# Altium schematic sheet Sheet4.SchDoc
size B; SheetNumber: 2; SheetTotal: 2
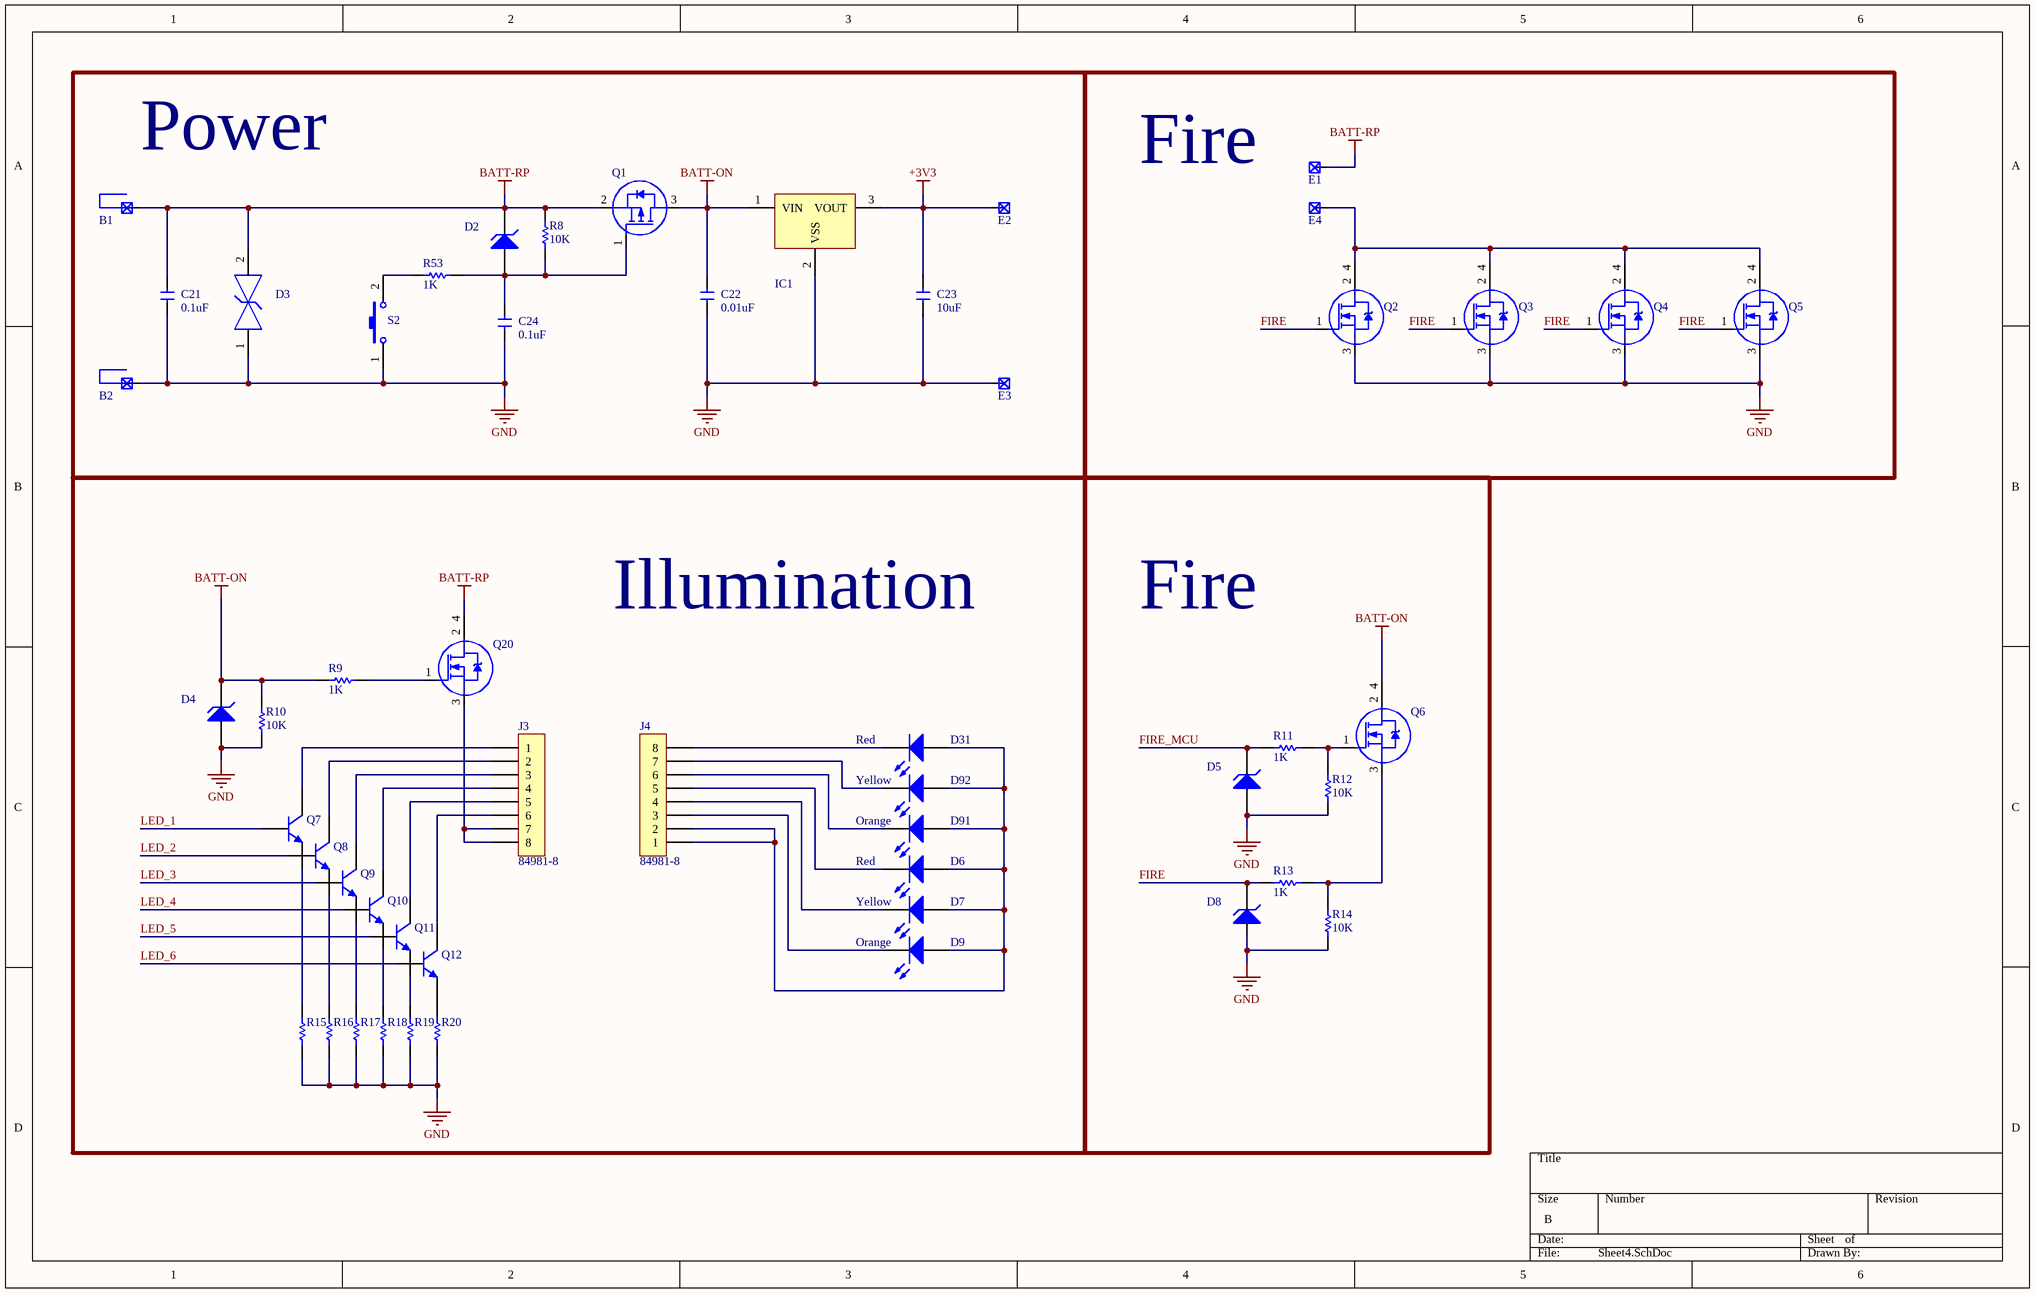
[diagram p0: Sheet4.SchDoc]

## Parts
B1  BATT CONTACT  [BATTERY CONTACT KEYSTONE 209]  (value not drawn)  (no BOM)
B2  BATT CONTACT  [BATTERY CONTACT KEYSTONE 209]  (value not drawn)  (no BOM)
C21  0.1uF  [CAPC2012N]
C22  0.01uF  [CAPC2012N]
C23  10uF  [CAPC2012N]
C24  0.1uF  [CAPC2012N]
D2  Diode, Zener, BZX84C18  [SOT23]  (value not drawn)
D3  SMAJ24CA  [FP-SMAJ-CA-MFG]  (value not drawn)
D4  Diode, Zener, BZX84C18  [SOT23]  (value not drawn)
D5  Diode, Zener, BZX84C18  [SOT23]  (value not drawn)
D6  LED_RED_0603  [LED_LTST-C190KRKT]  (value not drawn)
D7  LED_YELLOW_LTST-C194KSKT  [LED_LTST-C194KSKT]  (value not drawn)
D8  Diode, Zener, BZX84C18  [SOT23]  (value not drawn)
D9  LED_ORANGE_0603  [LED_LTST-C190KFKT]  (value not drawn)
D31  LED_RED_0603  [LED_LTST-C190KRKT]  (value not drawn)
D91  LED_ORANGE_0603  [LED_LTST-C190KFKT]  (value not drawn)
D92  LED_YELLOW_LTST-C194KSKT  [LED_LTST-C194KSKT]  (value not drawn)
E1  Testpoint  [Test_point]  (value not drawn)  (no BOM)
E2  Testpoint  [Test_point]  (value not drawn)  (no BOM)
E3  Testpoint  [Test_point]  (value not drawn)  (no BOM)
E4  Testpoint  [Test_point]  (value not drawn)  (no BOM)
IC1  LP2950  [DPAK-369C]  (value not drawn)
J3  84981-8  [84981-8]
J4  84981-8  [84981-8]
Q1  BSS84LT1G  [SOT23]  (value not drawn)
Q2  QD2PAK  [D2PAK]  (value not drawn)
Q3  QD2PAK  [D2PAK]  (value not drawn)
Q4  QD2PAK  [D2PAK]  (value not drawn)
Q5  QD2PAK  [D2PAK]  (value not drawn)
Q6  FQT7N10LTF  [SOT223-4N]  (value not drawn)
Q7  BC846B  [SOT23]  (value not drawn)
Q8  BC846B  [SOT23]  (value not drawn)
Q9  BC846B  [SOT23]  (value not drawn)
Q10  BC846B  [SOT23]  (value not drawn)
Q11  BC846B  [SOT23]  (value not drawn)
Q12  BC846B  [SOT23]  (value not drawn)
Q20  FQT7N10LTF  [SOT223-4N]  (value not drawn)
R8  10K  [RESC2012N]
R9  Resistance (Ohms): 1K  [RESC2012N]  (hidden comment: Res_1.0K_0805)
R10  10K  [RESC2012N]
R11  Resistance (Ohms): 1K  [RESC2012N]  (hidden comment: Res_1.0K_0805)
R12  10K  [RESC2012N]
R13  Resistance (Ohms): 1K  [RESC2012N]  (hidden comment: Res_1.0K_0805)
R14  10K  [RESC2012N]
R15  150  [RESC2012N]  (value not drawn)
R16  150  [RESC2012N]  (value not drawn)
R17  150  [RESC2012N]  (value not drawn)
R18  150  [RESC2012N]  (value not drawn)
R19  150  [RESC2012N]  (value not drawn)
R20  150  [RESC2012N]  (value not drawn)
R53  Resistance (Ohms): 1K  [RESC2012N]  (hidden comment: Res_1.0K_0805)
S2  SW_MX1A  [SW_CHERRY_MX1A-21NW]  (value not drawn)

## Blocks framed on the sheet
Power: B1 B2 C21-C24 D2 D3 E2 E3 IC1 Q1 R8 R53 S2
Fire: E1 E4 Q2-Q5
Illumination: D4 D6 D7 D9 D31 D91 D92 J3 J4 Q7-Q12 Q20 R9 R10 R15-R20
Fire: D5 D8 Q6 R11-R14

## Nets
+3V3: C23.2 E2.1(Test) IC1.3(VOUT)
BATT-ON: C22.2 D4.3(K) IC1.1(VIN) Q1.3 Q6.4(D) R9.2 R10.2
BATT-RP: B1.1(Test) C21.2 D2.3(K) D3.2 E1.1(Test) Q1.2 Q20.4(D) R8.2
GND: B2.1(Test) C21.1 C22.1 C23.1 C24.1 D3.1 D4.1(A) D5.1(A) D8.1(A) E3.1(Test) IC1.2(VSS) Q2.3(S) Q3.3(S) Q4.3(S) Q5.3(S) R10.1 R12.1 R14.1 R15.1 R16.1 R17.1 R18.1 R19.1 R20.1 S2.1
FIRE: D8.3(K) Q2.1(G) Q3.1(G) Q4.1(G) Q5.1(G) R13.2
FIRE_MCU: D5.3(K) R11.2
LED_1: Q7.1(B)
LED_2: Q8.1(B)
LED_3: Q9.1(B)
LED_4: Q10.1(B)
LED_5: Q11.1(B)
LED_6: Q12.1(B)
NetC24_2: C24.2 D2.1(A) Q1.1 R8.1 R53.1
NetD6_1: D6.1 J4.5
NetD6_2: D6.2 D7.2 D9.2 D31.2 D91.2 D92.2 J4.1 J4.2
NetD7_1: D7.1 J4.4
NetD9_1: D9.1 J4.3
NetD31_1: D31.1 J4.8
NetD91_1: D91.1 J4.6
NetD92_1: D92.1 J4.7
NetE4_1: E4.1(Test) Q2.4(D) Q3.4(D) Q4.4(D) Q5.4(D)
NetJ3_1: J3.1 Q7.3(C)
NetJ3_2: J3.2 Q8.3(C)
NetJ3_3: J3.3 Q9.3(C)
NetJ3_4: J3.4 Q10.3(C)
NetJ3_5: J3.5 Q11.3(C)
NetJ3_6: J3.6 Q12.3(C)
NetJ3_7: J3.7 J3.8 Q20.3(S)
NetQ6_1: Q6.1(G) R11.1 R12.2
NetQ6_3: Q6.3(S) R13.1 R14.2
NetQ7_2: Q7.2(E) R15.2
NetQ8_2: Q8.2(E) R16.2
NetQ9_2: Q9.2(E) R17.2
NetQ10_2: Q10.2(E) R18.2
NetQ11_2: Q11.2(E) R19.2
NetQ12_2: Q12.2(E) R20.2
NetQ20_1: Q20.1(G) R9.1
NetR53_2: R53.2 S2.2

Not connected (* = marked no-connect by the designer): Q2 2(D); Q3 2(D); Q4 2(D); Q5 2(D); Q6 2(D); Q20 2(D)

## Notes on the sheet
- Red
- (near D92) Yellow
- (near D91) Orange
- (near D7) Yellow
- (near D9) Orange

## Library data of the parts
B1 B2 = BATT_Contact_Keystone_209: Manufacturer: Keystone Electronics; Manufacturer P/N: 209; Body Plating: Nickel; Body Material: Steel; Voltage Rating: 0uV; Number of Batteries: 1; Insulation: Non-Insulated; Material Thickness: 0.012inch; Supplier 1: Digi-Key; Supplier Part Number 1: 36-209-ND; Mount: Snap in; Case/Package: Molded; Contact Plating: Nickel,Tin; Contact Material: Steel; Material: Brass,Steel; Package Quantity: 100; Termination: Solder; Voltage Rating (DC): 0uV; Length: 7.9mm; Height: 0.449inch; Depth: 11.4mm; Thickness: 0.012inch; REACH SVHC: No SVHC; Lead Free: Lead Free; ComponentLink2URL: http://www.keyelco.com/userAssets/file/M60-2p12.pdf; ComponentLink2Description: http://www.keyelco.com/userAssets/file/M60-2p12.pdf
C21 C24 = Cap_0.1uF_50V_0805: CAP CER 0.1UF 50V; Manufacturer: KEMET; Manufacturer P/N: C0805C104M5RACAUTO; Dielectric Material: Ceramic; Tolerance: 20%; Dielectric: X7R; Capacitance: 100nF; Supplier 1: Digi-Key; Supplier Part Number 1: 399-12977-1-ND; Mount: Surface Mount; Case/Package: 0805; Case Code (Metric): 2012; Case Code (Imperial): 0805; Contact Plating: Matte,Tin; Min Operating Temperature: -55°C; Max Operating Temperature: 125°C; Voltage Rating: 50V; Voltage Rating (DC): 50V; Termination: Wraparound; Length: 2mm; Width: 0.049inch; Thickness: 0.035inch; Depth: 1.25mm; Ratings: AEC-Q200; REACH SVHC: No SVHC
C22 = Cap_0.01uF_50V_0805: CAP CER 0.01UF 50V; Manufacturer: KEMET; Manufacturer P/N: C0805C103K5RAC-TU; Dielectric Material: Ceramic; Capacitance: 10nF; Tolerance: 10%; Dielectric: X7R; Supplier 1: Digi-Key; Supplier Part Number 1: 399-1158-6-ND; Mount: PCB,Surface Mount; Case/Package: 0805; Number of Pins: 2; Case Code (Metric): 2012; Case Code (Imperial): 0805; Min Operating Temperature: -55°C; Max Operating Temperature: 125°C; Voltage Rating (DC): 50V; Voltage Rating: 50V; Package Quantity: 1; Termination: SMD/SMT; Voltage: 50V; Length: 2mm; Height: 0.78mm; Width: 0.049inch; Lead Pitch: 0.75mm; Depth: 1.25mm; Thickness: 0.035inch; Radiation Hardening: No; REACH SVHC: No SVHC; ComponentLink1URL: http://www.kemet.com/kemet/web/homepage/kechome.nsf/vapubfiles/KEM_C1002_X7R_SMD.pdf/$file/KEM_C1002_X7R_SMD.pdf; ComponentLink1Description: http://www.kemet.com/kemet/web/homepage/kechome.nsf/vapubfiles/KEM_C1002_X7R_SMD.pdf/$file/KEM_C1002_X7R_SMD.pdf
C23 = Cap_10uF_10V_0805: CAP CER 10uF 10V 0805; Manufacturer: TDK; Manufacturer P/N: C2012X7R1A106K125AC; Dielectric Material: Ceramic; Tolerance: 10%; Dielectric: X7R; Supplier 1: Digi-Key; Supplier Part Number 1: 445-6857-1-ND; Mount: Surface Mount; Case/Package: 0805; Number of Pins: 2; Weight: 0.000194oz; Case Code (Metric): 2012; Case Code (Imperial): 0805; Contact Plating: Matte,Tin; Min Operating Temperature: -55°C; Max Operating Temperature: 125°C; Capacitance: 10uF; Voltage Rating: 10V; Package Quantity: 1; Voltage Rating (DC): 10V; Termination: SMD/SMT; Composition: Ceramic; Voltage: 10V; Length: 2mm; Height: 1.25mm; Width: 0.049inch; Thickness: 0.057inch; Depth: 1.25mm; Radiation Hardening: No; REACH SVHC: No SVHC; Lead Free: Lead Free; ComponentLink3URL: http://product.tdk.com/capacitor/mlcc/en/documents/mlcc_commercial_general_en.pdf; ComponentLink3Description: http://product.tdk.com/capacitor/mlcc/en/documents/mlcc_commercial_general_en.pdf
D2 D4 D5 D8 = Diode_BZX84C18: DIODE ZENER 18V 300mW SOT23; Manufacturer: Diodes; Manufacturer P/N: BZX84C18-7-F; Max Power Dissipation: 350mW; Max Reverse Leakage Current: 100nA; Tolerance: 6%; Zener Current: 5mA; Output Current: 18mA; Supplier 1: Digi-Key; Supplier Part Number 1: BZX84C18-FDICT-ND; Case/Package: SOT-23; Number of Pins: 3; Min Operating Temperature: -65°C; Max Operating Temperature: 150°C; Zener Voltage: 18V; Voltage Tolerance: 6%; Working Voltage: 18V; Peak Reverse Current: 100nA; Test Current: 5mA; Power Rating: 350mW; Voltage Rating (DC): 18V; Lead Free: Lead Free; ComponentLink1Description: https://www.diodes.com/assets/Datasheets/ds18001.pdf
D3 = CMP-2000-07087-2: TVS DIODE 24V 38.9V DO214AC; Manufacturer: Littelfuse; Peak Pulse Power: 400W; Direction: Bidirectional; Breakdown Voltage: 26.7V; Max Junction Temp: +150°C; Number Of Channels: 1; Description: 38.9V Clamp 10.3A Ipp Tvs Diode Surface Mount DO-214AC (SMA); Peak Pulse Current: 10.3A; Digikey Description: TVS DIODE 24V 38.9V DO214AC; Temperature Range Low: -65°C; Temperature: -65°C to +150°C; Manufacturer Part Number: SMAJ24CA; Octopart: https://octopart.com/smaj24ca-littelfuse-350011; Height: 2.29mm; Clamping Voltage: 38.9V; Device Class L1: Circuit Protection; Automotive: No; Device Class L2: TVS Diodes; Package: SMAJ-CA; ComponentLink2URL: https://www.littelfuse.com/~/media/electronics/datasheets/tvs_diodes/littelfuse_tvs_diode_smaj_datasheet.pdf.pdf; RoHS: TRUE; Temperature Range High: +150°C; Category: Diode; Lead Free: Yes; Reverse Standoff Voltage: 24V; Device Class L3: unset; ComponentLink2Description: Datasheet; Mouser Description: In a Pack of 25, Littelfuse SMAJ24CA, Bi-Directional TVS Diode, 400W, 2-Pin DO-214AC
D6 D31 = LED_RED_LTST-C190: LED RED 0603 SMD; Manufacturer: Vishay Lite-On; Manufacturer P/N: LTST-C190KRKT; Lens Color: Clear,Colorless; Luminous Intensity: 54mcd; Forward Current: 30mA; Viewing Angle: 130°; Forward Voltage: 2.4V; Lens Style: Clear,Colorless,Diffused,Rectangular; Power Rating: 75mW; Dominant Wavelength: 631nm; Test Current: 20mA; Lens Transparency: Clear; Number of Elements: 1; Wavelength: 639nm; Reverse Voltage: 5V; Supplier 1: Digi-Key; Supplier Part Number 1: 160-1436-1-ND; Mount: Surface Mount; Case/Package: 0603; Number of Pins: 2; Case Code (Metric): 1608; Case Code (Imperial): 0603; Min Operating Temperature: -55°C; Max Operating Temperature: 85°C; Package Quantity: 1; Illumination Color: Red; Power Dissipation: 75mW; Number of LEDs: 1; Length: 1.6mm; Height: 0.8mm; Width: 0.8mm; Depth: 0.8mm; Radiation Hardening: No; Lead Free: Lead Free; ComponentLink3URL: http://optoelectronics.liteon.com/upload/download/DS-22-99-0151/LTST-C190KRKT.pdf; ComponentLink3Description: http://optoelectronics.liteon.com/upload/download/DS-22-99-0151/LTST-C190KRKT.pdf; Color: Red
D7 D92 = LED_YELLOW_LTST-C194KSKT: LED YELLOW 0603 SMD; Manufacturer: Vishay Lite-On; Lens Color: Colorless; Forward Current: 5mA; Forward Voltage: 2V; Power Rating: 75mW; Luminous Intensity: 104mcd; Viewing Angle: 130°; Lens Style: Colorless,Diffused,Rectangular; Lens Transparency: Clear; Test Current: 20mA; Dominant Wavelength: 592nm; Number of LEDs: 1; Supplier 1: Digi-Key; Supplier Part Number 1: 160-1836-1-ND; Manufacturer P/N: LTST-C194KSKT; Mount: Surface Mount; Case/Package: 0603; Number of Pins: 2; Case Code (Metric): 1608; Case Code (Imperial): 0603; Min Operating Temperature: -30°C; Max Operating Temperature: 85°C; Illumination Color: Yellow; Package Quantity: 3000; Length: 1.6mm; Height: 0.35mm; Width: 0.8mm; Radiation Hardening: No; ComponentLink1URL: http://optoelectronics.liteon.com/upload/download/DS22-2006-114/LTST-C194KSKT.PDF; ComponentLink1Description: http://optoelectronics.liteon.com/upload/download/DS22-2006-114/LTST-C194KSKT.PDF; Color: Yellow
D9 D91 = LED_ORANGE_LTST-C190KFKT: LED ORANGE 0603 SMD; Manufacturer: Vishay Lite-On; Lens Color: Clear,Colorless; Power Rating: 75mW; Luminous Intensity: 90mcd; Viewing Angle: 130°; Forward Current: 30mA; Forward Voltage: 2V; Lens Style: Clear,Colorless,Diffused,Rectangular; Dominant Wavelength: 605nm; Test Current: 20mA; Lens Transparency: Clear; Number of Elements: 1; Wavelength: 611nm; Reverse Voltage: 5V; Supplier 1: Digi-Key; Supplier Part Number 1: 160-1434-2-ND; Manufacturer P/N: LTST-C190KFKT; Mount: Surface Mount; Case/Package: 0603; Number of Pins: 2; Case Code (Metric): 1608; Case Code (Imperial): 0603; Min Operating Temperature: -55°C; Max Operating Temperature: 85°C; Package Quantity: 1; Illumination Color: Orange; Power Dissipation: 75mW; Number of LEDs: 1; Length: 3.2mm; Height: 0.8mm; Width: 0.8mm; Depth: 1.6mm; Radiation Hardening: No; Lead Free: Lead Free; ComponentLink3URL: http://optoelectronics.liteon.com/upload/download/DS-22-99-0186/LTST-C190KFKT.PDF; ComponentLink3Description: http://optoelectronics.liteon.com/upload/download/DS-22-99-0186/LTST-C190KFKT.PDF; Color: Orange
E1-E4 = Test Point: Value: Test Point
IC1 = LP2950: Voltage Regulator; Manufacturer: ON Semiconductor; Manufacturer P/N: LP2950ACDT-3.3RG; Dropout Voltage: 350mV; Max Input Voltage: 30V; Output Voltage: 3.3V; Output Current: 100mA; Number of Outputs: 1; Input Bias Current: 75uA; Reference Voltage: 1.25V; Polarity: Positive; Accuracy: 0.5%; Output Type: Fixed; Supplier 1: Digi-Key; Supplier Part Number 1: LP2950ACDT-3.3RGOSCT-ND; Mount: Surface Mount; Case/Package: DPAK; Number of Pins: 3; Contact Plating: Matte,Tin; Min Operating Temperature: -40°C; Max Operating Temperature: 125°C; Package Quantity: 1; Max Output Current: 100mA; Number of Regulators: 1; Quiescent Current: 75uA; Nominal Output Voltage: 3.3V; Output Voltage Accuracy: 0.5%; Length: 6.73mm; Height: 2.38mm; Width: 6.22mm; Radiation Hardening: No; REACH SVHC: No SVHC; Lead Free: Lead Free; Halogen Free: Halogen Free; ComponentLink1URL: http://www.onsemi.com/pub/Collateral/LP2950-D.PDF; ComponentLink1Description: http://www.onsemi.com/pub/Collateral/LP2950-D.PDF; ComponentLink2URL: http://www.onsemi.jp/pub/Collateral/LP2950-D.PDF; ComponentLink2Description: http://www.onsemi.jp/pub/Collateral/LP2950-D.PDF
Q1 = BSS84LT1G: MOSFET P-CH 50V 130mA SOT-23; Manufacturer: ON Semiconductor; Manufacturer P/N: BSS84LT1-G; Rise Time: 1ns; Rds On Max: 10R; Input Capacitance: 30pF; Max Power Dissipation: 225mW; Turn-Off Delay Time: 16ns; Turn-On Delay Time: 3.6ns; Gate to Source Voltage (Vgs): 20V; Nominal Vgs: 2V; Threshold Voltage: -2V; Element Configuration: Single; Voltage Rating (DC): -50V; Current Rating: -130mA; Supplier 1: Digi-Key; Supplier Part Number 1: BSS84LT1GOSCT-ND; Case/Package: SOT-23-3; Number of Pins: 3; Contact Plating: Matte,Tin; Min Operating Temperature: -55°C; Max Operating Temperature: 150°C; Drain to Source Voltage (Vdss): 50V; Continuous Drain Current (ID): 130mA; Fall Time: 1ns; Power Dissipation: 225mW; Drain to Source Breakdown Voltage: 50V; Drain to Source Resistance: 10R; On-State Resistance: 10R; Radiation Hardening: No; Lead Free: Lead Free; REACH SVHC: No SVHC; Halogen Free: Halogen Free; ComponentLink3URL: http://www.onsemi.com/pub/Collateral/BSS84LT1-D.PDF; ComponentLink3Description: Datasheet
Q2-Q5 = IRFZ46NSTRL: MOSFET N-CH 55V 53A D2PAK
Q6 Q20 = FET_N-Chan_SOT-223: MOSFET N-CH 30V 0.8A SOT416; Manufacturer: ON Semiconductor / Fairchild; Rds On Max: 350mR; Input Capacitance: 290pF; Rise Time: 100ns; Number of Elements: 1; Max Power Dissipation: 2W; Drain to Source Voltage (Vdss): 100V; Continuous Drain Current (ID): 1.7A; Fall Time: 50ns; Turn-Off Delay Time: 17ns; Turn-On Delay Time: 9ns; Threshold Voltage: 2V; Element Configuration: Single; Gate to Source Voltage (Vgs): 20V; Supplier 1: Digi-Key; Supplier Part Number 1: FQT7N10LTFDKR-ND; Manufacturer P/N: FQT7N10LTF; Mount: Surface Mount; Case/Package: SOT-223; Number of Pins: 3; Weight: 0.188g; Contact Plating: Matte,Tin; Min Operating Temperature: -55°C; Max Operating Temperature: 150°C; Package Quantity: 4000; Drain to Source Breakdown Voltage: 100V; Drain to Source Resistance: 350mR; Power Dissipation: 2W; Voltage Rating (DC): 100V; Current Rating: 1.7A; On-State Resistance: 350mR; Length: 6.5mm; Height: 1.6mm; Width: 3.56mm; Radiation Hardening: No; REACH SVHC: No SVHC; Lead Free: Lead Free; ComponentLink1URL: https://www.fairchildsemi.com/datasheets/FQ/FQT7N10L.pdf; ComponentLink1Description: https://www.fairchildsemi.com/datasheets/FQ/FQT7N10L.pdf; ComponentLink2URL: https://www.fairchildsemi.com/package-drawings/MA/MA04A.pdf; ComponentLink2Description: https://www.fairchildsemi.com/package-drawings/MA/MA04A.pdf; ComponentLink3URL: https://www.verical.com/server-webapp/html/getDatasheet?partID=60091; ComponentLink3Description: https://www.verical.com/server-webapp/html/getDatasheet?partID=60091; ComponentLink4URL: http://www.mouser.com/ds/2/149/FQT7N10L-244343.pdf; ComponentLink4Description: http://www.mouser.com/ds/2/149/FQT7N10L-244343.pdf; ComponentLink5URL: http://www.jameco.com/Jameco/Products/ProdDS/933775.pdf; ComponentLink5Description: http://www.jameco.com/Jameco/Products/ProdDS/933775.pdf; ComponentLink6URL: http://datasheet.iiic.cc/fairchild/FQT7N10LTF.pdf; ComponentLink6Description: http://datasheet.iiic.cc/fairchild/FQT7N10LTF.pdf
Q7-Q12 = BC846B: TRAN NPN 100MA 65V; Manufacturer: NXP Semiconductors; Vce Saturation (Max) @ Ib, Ic: 400mV @ 5mA, 100mA; DC Current Gain (hFE) (Min) @ Ic, Vce: 200 @ 2mA, 5V; Power - Max: 250mW; Frequency - Transition: 100MHz; Supplier 1: Digi-Key; Supplier Part Number 1: 568-1632-1-ND; RoHS: RoHS Compliant; Transistor Type: NPN; Current - Collector (Ic) (Max): 100mA; Voltage - Collector Emitter Breakdown (Max): 65V; Current - Collector Cutoff (Max): -; Package / Case: TO-236-3, SC-59, SOT-23-3; ComponentLink1URL: http://media.digikey.com/pdf/Data%20Sheets/NXP%20PDFs/BC846,%20BC546%20Series.pdf; ComponentLink1Description: Datasheet; Supplier 2: Digi-Key; Supplier Part Number 2: 568-1632-2-ND; Manufacturer P/N: BC846B
R8 R10 R12 R14 = Res_10K_0805: RES 10K OHM 1/8W 1% 0805; Manufacturer: Vishay; Manufacturer P/N: CRCW080510K0FKEA; Resistance: 10kR; Power Rating: 125mW; Voltage Rating: 150V; Temperature Coefficient: 100ppm/°C; Supplier 1: Digi-Key; Supplier Part Number 1: 541-10.0KCCT-ND; Case/Package: 0805; Weight: 0.000194oz; Case Code (Imperial): 0805; Case Code (Metric): 2012; Contact Plating: Tin; Min Operating Temperature: -55°C; Max Operating Temperature: 155°C; Tolerance: 1%; Package Quantity: 5000; Composition: Thick Film; Military Standard: Not; Termination: SMD/SMT; Voltage Rating (DC): 150V; Length: 2mm; Height: 0.45mm; Width: 1.25mm; Depth: 1.25mm; Radiation Hardening: No; REACH SVHC: Unknown; Lead Free: Lead Free; ComponentLink4URL: http://www.vishay.com/docs/20035/dcrcwe3.pdf; ComponentLink4Description: http://www.vishay.com/docs/20035/dcrcwe3.pdf
R9 R11 R13 R53 = Res_1.0K_0805: RES 1.0K OHM 1/8W 1% 0805; Manufacturer P/N: RC0805FR-071KL; Manufacturer: Yageo; Power (Watts): 0.125W, 1/8W; Temperature Coefficient: ±100ppm/°C; Supplier 1: Digi-Key; Supplier Part Number 1: 311-1.00KCRCT-ND; RoHS: RoHS Compliant; Composition: Thick Film; Tolerance: ±1%; Package / Case: 0805 (2012 Metric); ComponentLink1URL: http://www.yageo.com/documents/recent/PYu-RC0805_51_RoHS_L_5.pdf; ComponentLink1Description: Datasheet; Supplier 2: Digi-Key; Supplier Part Number 2: 311-1.00KCRTR-ND
R15-R20 = Res_150_0805: RES 150 OHM 1/8W 1% 0805; Manufacturer: Vishay; Manufacturer P/N: CRCW0805150RFKEA; Power Rating: 125mW; Resistance: 150R; Voltage Rating: 150V; Temperature Coefficient: 100ppm/°C; Supplier 1: Digi-Key; Supplier Part Number 1: 541-150CCT-ND; Mount: Surface Mount; Case/Package: 0805; Weight: 0.000194oz; Case Code (Metric): 2012; Case Code (Imperial): 0805; Contact Plating: Tin; Min Operating Temperature: -55°C; Max Operating Temperature: 155°C; Tolerance: 1%; Package Quantity: 10; Composition: Thick Film; Termination: SMD/SMT; Max Power Dissipation: 125mW; Voltage Rating (DC): 150V; Features: Automotive AEC-Q200; Military Standard: Not; Length: 2mm; Height: 0.45mm; Width: 0.049inch; Depth: 1.25mm; Radiation Hardening: No; Lead Free: Lead Free; REACH SVHC: Unknown; ComponentLink3URL: http://www.vishay.com/docs/20035/dcrcwe3.pdf; ComponentLink3Description: http://www.vishay.com/docs/20035/dcrcwe3.pdf
S2 = SW_MX1A: SWITCH PUSH BUTTON; Manufacturer: Cherry; Manufacturer P/N: MX1A-21NW; Mechanical Life: 50000000Cycles; Throw Configuration: SPST; Voltage Rating (AC): 12V; Max Current Rating: 10mA; Contact Resistance: 200mR; Operating Force: 0.58N; Switch Function: Off-Mom; Row Spacing: 2.54mm; Actuator Length: 3.6mm; Supplier 1: Digi-Key; Supplier Part Number 1: MX1A21NW-ND; Mount: Through Hole; Contact Plating: Gold; Contact Material: Gold,Silver; Number of Terminals: 2; Housing Material: Thermoplastic; Min Operating Temperature: -10°C; Max Operating Temperature: 70°C; Package Quantity: 1000; Voltage Rating (DC): 12V; Current Rating: 10mA; Max Voltage Rating (AC): 12V; Max Voltage Rating (DC): 12V; Termination: PC Pin; Electrical Life: 50000000Cycles; Orientation: Straight; Contact Current Rating: 10mA; Terminal Pitch: 6.35mm; Lead Free: Lead Free
J3 J4 = 84981-8: Supplier 1: Digi-Key; Supplier Part Number 1: A100245CT-ND